# Altium schematic sheet ESP_8266.SchDoc
size A4; SheetNumber: 6; SheetTotal: 9
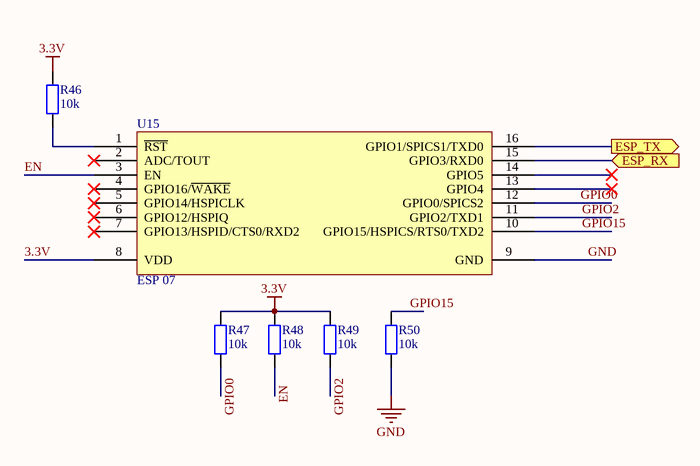
[diagram p0: ESP_8266.SchDoc]

## Parts
R46  10k  [tro smd 0805]
R47  10k  [tro smd 0805]
R48  10k  [tro smd 0805]
R49  10k  [tro smd 0805]
R50  10k  [tro smd 0805]
U15  ESP 07  [ESP8266 07]

## Ports
ESP_RX (in), ESP_TX (out)

## Nets
3.3V: R46.2 R47.2 R48.2 R49.2 U15.8(VDD)
GND: R50.1 U15.9(GND)
EN: R48.1 U15.3(EN)
ESP_RX: U15.15(GPIO3/RXD0) ; port ESP_RX
ESP_TX: U15.16(GPIO1/SPICS1/TXD0) ; port ESP_TX
GPIO0: R47.1 U15.12(GPIO0/SPICS2)
GPIO2: R49.1 U15.11(GPIO2/TXD1)
GPIO15: R50.2 U15.10(GPIO15/HSPICS/RTS0/TXD2)
NetR46_1: R46.1 U15.1(~{RST})

Not connected (* = marked no-connect by the designer): U15 2(ADC/TOUT)* 4(GPIO16/~{WAKE})* 5(GPIO14/HSPICLK)* 6(GPIO12/HSPIQ)* 7(GPIO13/HSPID/CTS0/RXD2)* 13(GPIO4)* 14(GPIO5)*

## Library data of the parts
R46-R50 = Tro 0805 1% 10k: Dán; Don_Vi: Con; So_Chan: 2; Ten_Linh_Kien: Trở 0805 1% 10k; Ma_Hang: MH005473; Chung_Loai: Dán; Kieu_Chan: *
U15 = ESP8266 07: ESP8266 07 16 Pin; IC: ESP8266-EX; Vendor: Ai-thinker